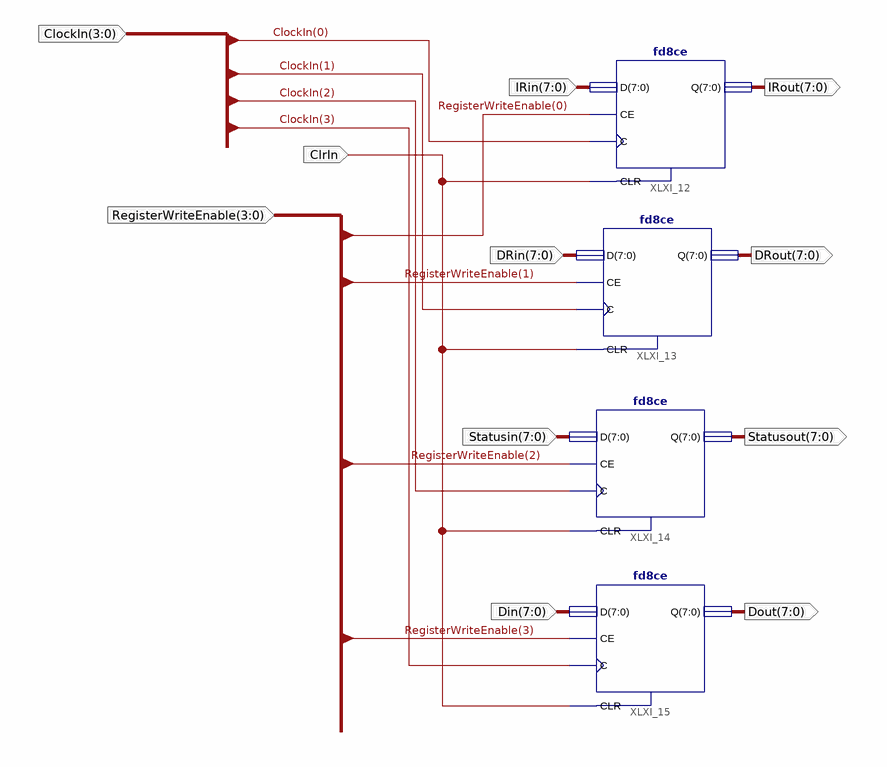
[diagram p0: schematic sheet 1]
// Xilinx ISE schematic IrDrRegisters.sch (spartan3e) as structural Verilog: 4 symbols, 11 ports
module IrDrRegisters (
  input  [7:0] Statusin,
  input  [7:0] DRin,
  input  [7:0] IRin,
  input  ClrIn,
  input  [3:0] RegisterWriteEnable,
  input  [7:0] Din,
  input  [3:0] ClockIn,
  output [7:0] IRout,
  output [7:0] DRout,
  output [7:0] Statusout,
  output [7:0] Dout
);

  fd8ce XLXI_12 (.C(ClockIn[0]), .CE(RegisterWriteEnable[0]), .CLR(ClrIn), .D(IRin), .Q(IRout));
  fd8ce XLXI_13 (.C(ClockIn[1]), .CE(RegisterWriteEnable[1]), .CLR(ClrIn), .D(DRin), .Q(DRout));
  fd8ce XLXI_14 (.C(ClockIn[2]), .CE(RegisterWriteEnable[2]), .CLR(ClrIn), .D(Statusin), .Q(Statusout));
  fd8ce XLXI_15 (.C(ClockIn[3]), .CE(RegisterWriteEnable[3]), .CLR(ClrIn), .D(Din), .Q(Dout));
endmodule
